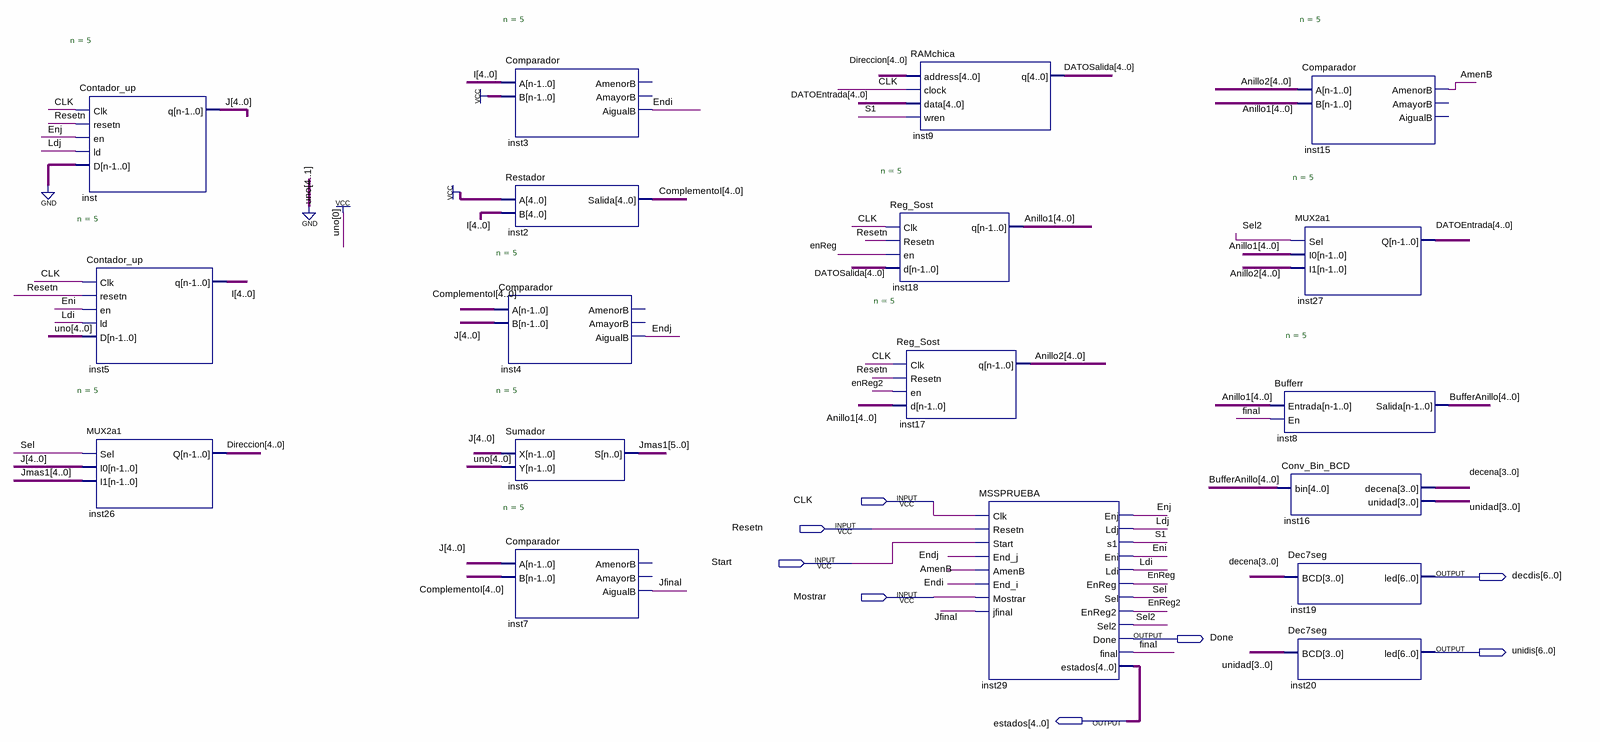
[diagram p0: schematic sheet]
// Quartus schematic DiagramaDeBloquesFinal.bdf as structural Verilog: 18 symbols, 8 pins
module DiagramaDeBloquesFinal (
  input  CLK,
  input  Resetn,
  input  Start,
  input  Mostrar,
  output [6:0] decdis,
  output Done,
  output [6:0] unidis,
  output [4:0] estados
);

  wire AmenB, Endi, Endj, Eni, Enj, enReg, EnReg2, \final , Jfinal, Ldi, Ldj, S1, Sel, Sel2;
  wire [3:0] decena, unidad;
  wire [4:0] Anillo1, Anillo2, BufferAnillo, ComplementoI, DATOEntrada, DATOSalida, Direccion, I, J;
  wire [5:0] Jmas1;

  Contador_up #(.n(5)) inst (.Clk(CLK), .resetn(Resetn), .en(Enj), .ld(Ldj), .D({5{1'b0}}), .q(J));
  Contador_up #(.n(5)) inst5 (.Clk(CLK), .resetn(Resetn), .en(Eni), .ld(Ldi), .D(5'b00001), .q(I));
  MUX2a1 #(.n(5)) inst26 (.Sel(Sel), .I0(J), .I1(Jmas1[4:0]), .Q(Direccion));
  Comparador #(.n(5)) inst3 (.A(I), .B({5{1'b1}}), .AigualB(Endi));  // open: AmenorB, AmayorB
  Restador inst2 (.A({5{1'b1}}), .B(I), .Salida(ComplementoI));
  Comparador #(.n(5)) inst4 (.A(ComplementoI), .B(J), .AigualB(Endj));  // open: AmenorB, AmayorB
  Sumador #(.n(5)) inst6 (.X(J), .Y(5'b00001), .S(Jmas1));
  Comparador #(.n(5)) inst7 (.A(J), .B(ComplementoI), .AigualB(Jfinal));  // open: AmenorB, AmayorB
  Reg_Sost #(.n(5)) inst18 (.Clk(CLK), .Resetn(Resetn), .en(enReg), .d(DATOSalida), .q(Anillo1));
  Reg_Sost #(.n(5)) inst17 (.Clk(CLK), .Resetn(Resetn), .en(EnReg2), .d(Anillo1), .q(Anillo2));
  RAMchica inst9 (.address(Direccion), .clock(CLK), .data(DATOEntrada), .wren(S1), .q(DATOSalida));
  MSSPRUEBA inst29 (
    .Clk(CLK), .Resetn(Resetn), .Start(Start), .End_j(Endj), .AmenB(AmenB), .End_i(Endi), .Mostrar(Mostrar),
    .jfinal(Jfinal), .Enj(Enj), .Ldj(Ldj), .s1(S1), .Eni(Eni), .Ldi(Ldi), .EnReg(enReg), .Sel(Sel),
    .EnReg2(EnReg2), .Sel2(Sel2), .Done(Done), .\final (\final ), .estados(estados));
  Bufferr #(.n(5)) inst8 (.Entrada(Anillo1), .En(\final ), .Salida(BufferAnillo));
  Conv_Bin_BCD inst16 (.bin(BufferAnillo), .decena(decena), .unidad(unidad));
  Comparador #(.n(5)) inst15 (.A(Anillo2), .B(Anillo1), .AmenorB(AmenB));  // open: AmayorB, AigualB
  MUX2a1 #(.n(5)) inst27 (.Sel(Sel2), .I0(Anillo1), .I1(Anillo2), .Q(DATOEntrada));
  Dec7seg inst19 (.BCD(decena), .led(decdis));
  Dec7seg inst20 (.BCD(unidad), .led(unidis));
endmodule
